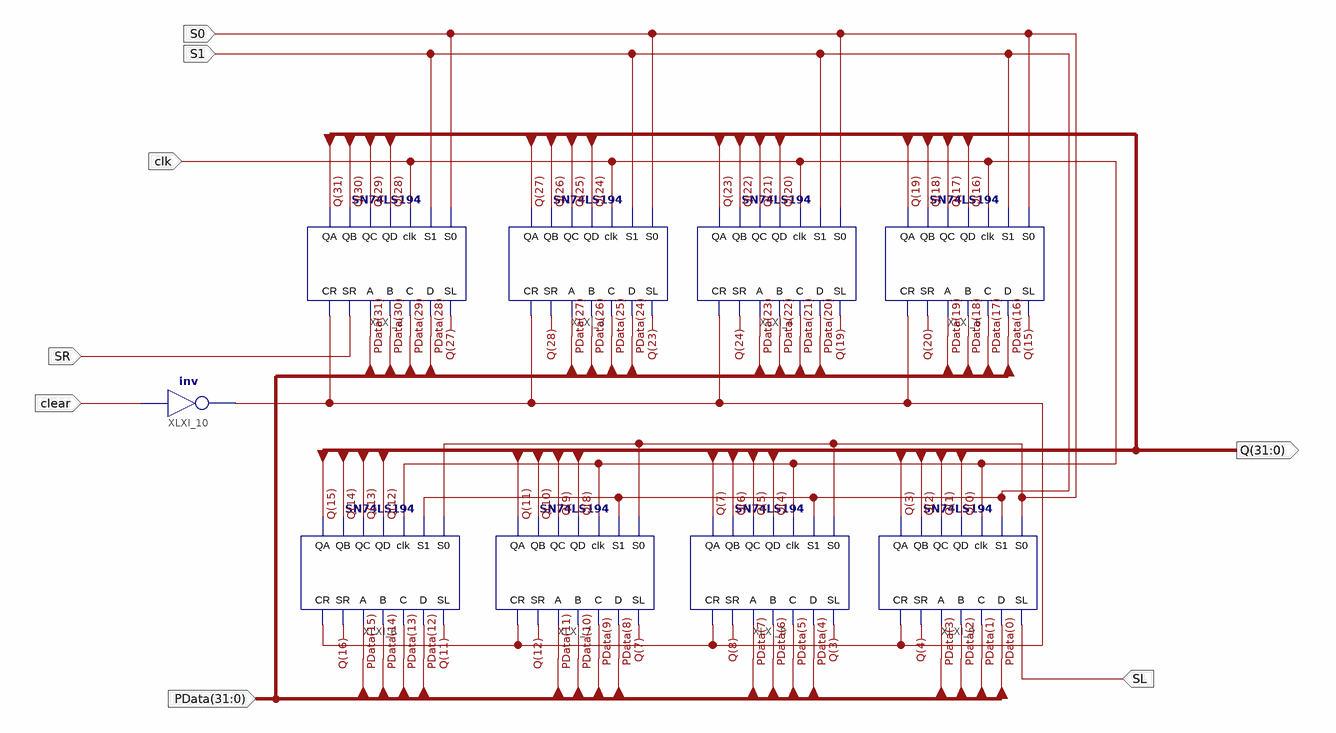
[diagram p0: schematic sheet 1]
// Xilinx ISE schematic Shift_32.sch (kintex7) as structural Verilog: 9 symbols, 8 ports
module Shift_32 (
  input  clk,
  input  SR,
  input  clear,
  input  [31:0] PData,
  input  SL,
  input  S1,
  input  S0,
  output [31:0] Q
);

  wire XLXN_11;

  SN74LS194 XLXI_2 (
    .clk(clk), .CR(XLXN_11), .S1(S1), .S0(S0), .SR(SR), .A(PData[31]), .B(PData[30]), .C(PData[29]),
    .D(PData[28]), .SL(Q[27]), .QA(Q[31]), .QB(Q[30]), .QC(Q[29]), .QD(Q[28]));
  SN74LS194 XLXI_3 (
    .clk(clk), .CR(XLXN_11), .S1(S1), .S0(S0), .SR(Q[28]), .A(PData[27]), .B(PData[26]), .C(PData[25]),
    .D(PData[24]), .SL(Q[23]), .QA(Q[27]), .QB(Q[26]), .QC(Q[25]), .QD(Q[24]));
  SN74LS194 XLXI_4 (
    .clk(clk), .CR(XLXN_11), .S1(S1), .S0(S0), .SR(Q[24]), .A(PData[23]), .B(PData[22]), .C(PData[21]),
    .D(PData[20]), .SL(Q[19]), .QA(Q[23]), .QB(Q[22]), .QC(Q[21]), .QD(Q[20]));
  SN74LS194 XLXI_5 (
    .clk(clk), .CR(XLXN_11), .S1(S1), .S0(S0), .SR(Q[20]), .A(PData[19]), .B(PData[18]), .C(PData[17]),
    .D(PData[16]), .SL(Q[15]), .QA(Q[19]), .QB(Q[18]), .QC(Q[17]), .QD(Q[16]));
  SN74LS194 XLXI_6 (
    .clk(clk), .CR(XLXN_11), .S1(S1), .S0(S0), .SR(Q[16]), .A(PData[15]), .B(PData[14]), .C(PData[13]),
    .D(PData[12]), .SL(Q[11]), .QA(Q[15]), .QB(Q[14]), .QC(Q[13]), .QD(Q[12]));
  SN74LS194 XLXI_7 (
    .clk(clk), .CR(XLXN_11), .S1(S1), .S0(S0), .SR(Q[12]), .A(PData[11]), .B(PData[10]), .C(PData[9]),
    .D(PData[8]), .SL(Q[7]), .QA(Q[11]), .QB(Q[10]), .QC(Q[9]), .QD(Q[8]));
  SN74LS194 XLXI_8 (
    .clk(clk), .CR(XLXN_11), .S1(S1), .S0(S0), .SR(Q[8]), .A(PData[7]), .B(PData[6]), .C(PData[5]),
    .D(PData[4]), .SL(Q[3]), .QA(Q[7]), .QB(Q[6]), .QC(Q[5]), .QD(Q[4]));
  SN74LS194 XLXI_9 (
    .clk(clk), .CR(XLXN_11), .S1(S1), .S0(S0), .SR(Q[4]), .A(PData[3]), .B(PData[2]), .C(PData[1]),
    .D(PData[0]), .SL(SL), .QA(Q[3]), .QB(Q[2]), .QC(Q[1]), .QD(Q[0]));
  not XLXI_10 (XLXN_11, clear);
endmodule
